# EAGLE design sa612_lm386 (EAGLE 9.6.2)
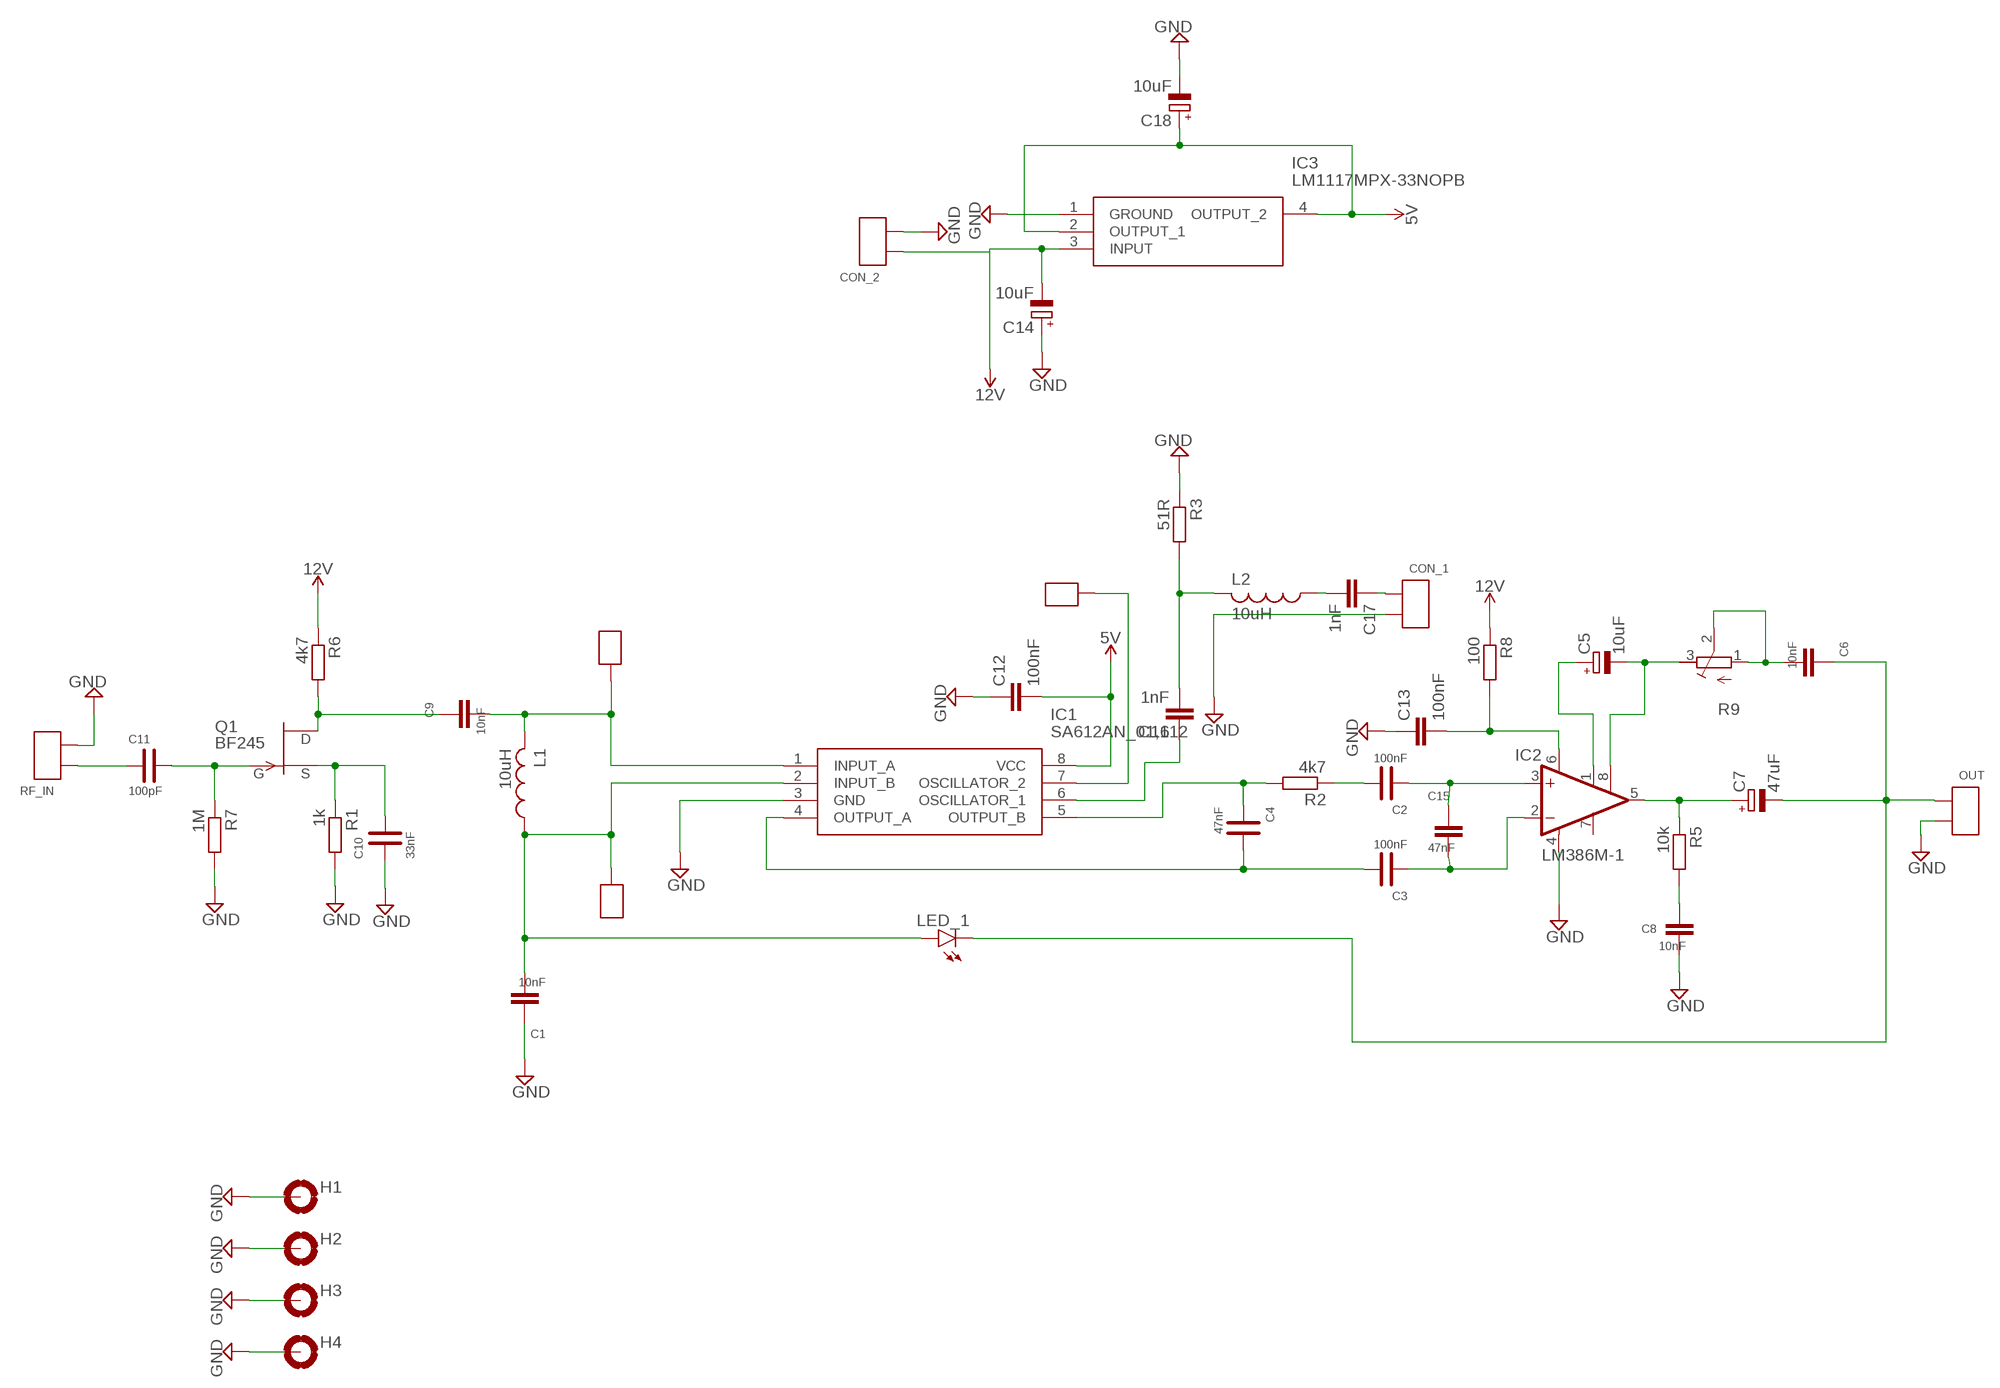
[diagram p0: schematic, sheet 1]

## Parts
C1  10nF  C_0805_SMD  [C0805]
C2  100nF  C_0805_PTH  [C0805K]
C3  100nF  C_0805_PTH  [C0805K]
C4  47nF  C_0805_PTH  [C0805K]
C5  10uF  C_POL  [E5-5]
C6  10nF  C_0805_SMD  [C0805]
C7  47uF  C_POL  [E5-5]
C8  10nF  C_0805_SMD  [C0805]
C9  10nF  C_0805_SMD  [C0805]
C10  33nF  C_0805_PTH  [C0805K]
C11  100pF  C_0805_PTH  [C0805K]
C12  100nF  C_0805_SMD  [C0805]
C13  100nF  C_0805_SMD  [C0805]
C14  10uF  C_POL  [E5-5]
C15  47nF  C_0805_SMD  [C0805]
C16  1nF  C_0805_SMD  [C0805]
C17  1nF  C_0805_SMD  [C0805]
C18  10uF  C_POL  [E5-5]
CON_1  2X_SMD_PTH_PIN  [2X_SMD_PTH]
CON_2  2X_SMD_PTH_PIN  [2X_SMD_PTH]
H1  MOUNT-PAD-ROUND3.0  [3,0-PAD]
H2  MOUNT-PAD-ROUND3.0  [3,0-PAD]
H3  MOUNT-PAD-ROUND3.0  [3,0-PAD]
H4  MOUNT-PAD-ROUND3.0  [3,0-PAD]
IC1  SA612AN_01,112  [DIP762W53P254L950H420Q8N]
IC2  LM386M-1  [SO08]
IC3  LM1117MPX-33NOPB  [SOT230P700X180-4N]
IN_A  SMD_PIN  [SMD_PIN]
IN_B  SMD_PIN  [SMD_PIN]
L1  10uH  L_0805_PTH  [M0805]
L2  10uH  L_0805_PTH  [M0805]
LED_1  LED_0805_PTH  [CHIP-LED0805]
OUT  2X_SMD_PTH_PIN  [2X_SMD_PTH]
P_1  SMD_PIN  [SMD_PIN]
Q1  BF245  [TO92]
R1  1k  R_0805_PTH  [R0805]
R2  4k7  R_0805_SMD  [R0805W]
R3  51R  R_0805_SMD  [R0805W]
R5  10k  R_0805_SMD  [R0805W]
R6  4k7  R_0805_PTH  [R0805]
R7  1M  R_0805_PTH  [R0805]
R8  100  R_0805_SMD  [R0805W]
R9  R-TRIMM64W  [RTRIM64W]
RF_IN  2X_SMD_PTH_PIN  [2X_SMD_PTH]

## Nets
5V: C12.2 C18.+ IC1.8(VCC) IC3.2(OUTPUT_1) IC3.4(OUTPUT_2)
12V: C14.- CON_2.P$1(PIN0) CON_2.T$1(PIN0) IC3.3(INPUT) R6.1 R6.P$1 R8.1
GND: C1.1 C8.2 C10.1 C10.P$1 C12.1 C13.1 C14.+ C18.- CON_1.P$2(PIN1) CON_1.T$2(PIN1) CON_2.P$2(PIN1) CON_2.T$2(PIN1) H1.B3,0(MOUNT) H2.B3,0(MOUNT) H3.B3,0(MOUNT) H4.B3,0(MOUNT) IC1.3(GND) IC2.4(GND) IC3.1(GROUND) OUT.P$2(PIN1) OUT.T$2(PIN1) R1.2 R1.P$2 R3.1 R7.2 R7.P$2 RF_IN.P$2(PIN1) RF_IN.T$2(PIN1)
N$1: C9.2 IC1.1(INPUT_A) IN_A.P$1 L1.2 L1.P$2
N$2: C1.2 IC1.2(INPUT_B) IN_B.P$1 L1.1 L1.P$1 LED_1.A LED_1.AP(A)
N$3: C2.1 C2.P$1 C15.1 IC2.3(+IN)
N$4: C3.1 C3.P$1 C15.2 IC2.2(-IN)
N$5: C16.2 L2.2 L2.P$2 R3.2
N$6: C2.2 C2.P$2 R2.1
N$7: C4.1 C4.P$1 IC1.5(OUTPUT_B) R2.2
N$8: C3.2 C3.P$2 C4.2 C4.P$2 IC1.4(OUTPUT_A)
N$9: C16.1 IC1.6(OSCILLATOR_1)
N$10: IC1.7(OSCILLATOR_2) P_1.P$1
N$11: C5.+ IC2.1(GAIN)
N$12: C5.- IC2.8(GAIN) R9.3(E)
N$13: C6.2 R9.1(A) R9.2(S)
N$14: C6.1 C7.- LED_1.C LED_1.CP(C) OUT.P$1(PIN0) OUT.T$1(PIN0)
N$15: C7.+ IC2.5(OUT) R5.1
N$16: C8.1 R5.2
N$17: C10.2 C10.P$2 Q1.2(S) R1.1 R1.P$1
N$18: C9.1 Q1.1(D) R6.2 R6.P$2
N$19: C11.2 C11.P$2 Q1.3(G) R7.1 R7.P$1
N$20: C11.1 C11.P$1 RF_IN.P$1(PIN0) RF_IN.T$1(PIN0)
N$21: C13.2 IC2.6(VS) R8.2
N$22: C17.1 CON_1.P$1(PIN0) CON_1.T$1(PIN0)
N$23: C17.2 L2.1 L2.P$1
Unconnected: IC2.7(BYPASS)

## Library data of the parts
C1 C6 C8 C9 C12 C13 C15-C17 = mylib:C_0805_SMD
C2-C4 C10 C11 = mylib:C_0805_PTH
C5 C7 C14 C18 = mylib:C_POL
CON_1 CON_2 OUT RF_IN = mylib:2X_SMD_PTH_PIN
H1-H4 = holes:MOUNT-PAD-ROUND: MOUNTING PAD, round
IC1 = SA612AN_01_112:SA612AN_01,112: NXP SA612AN, Mixer Circuit Gain=17 dB 4.5 8 V 8-Pin PDIP Source: Datasheet <https://datasheet.datasheetarchive.com/originals/distributors/Datasheets_SAMA/f801acdc6cb9d9748f3d91798dd5a70c.pdf>; DESCRIPTION: NXP SA612AN, Mixer Circuit Gain=17 dB 4.5 8 V 8-Pin PDIP; HEIGHT: 4.2mm; MANUFACTURER_NAME: Nexperia; MANUFACTURER_PART_NUMBER: SA612AN/01,112; MOUSER_PART_NUMBER: 771-SA612AN/01; MOUSER_PRICE-STOCK: https://www.mouser.com/Search/Refine.aspx?Keyword=771-SA612AN%2F01
IC2 = linear:LM386?-*: Low Voltage Audio Power Amplifier Source: http://cache.national.com/ds/LM/LM386.pdf
IC3 = LM1117MPX-33NOPB:LM1117MPX-33NOPB: LDO Voltage Regulators 800-mA 15-V linear voltage regulator 800-mA 15-V linear voltage regulator Source: Datasheet <https://www.arrow.com/en/products/lm1117mpx-33nopb/on-semiconductor>; ARROW_PART_NUMBER: LM1117MPX-33NOPB; ARROW_PRICE-STOCK: https://www.arrow.com/en/products/lm1117mpx-33nopb/on-semiconductor?region=nac; DESCRIPTION: LDO Voltage Regulators 800-mA 15-V linear voltage regulator 800-mA 15-V linear voltage regulator; HEIGHT: 1.8mm; MANUFACTURER_NAME: onsemi; MANUFACTURER_PART_NUMBER: LM1117MPX-33NOPB; MOUSER_PART_NUMBER: 863-LM1117MPX-33NOPB; MOUSER_PRICE-STOCK: https://www.mouser.co.uk/ProductDetail/onsemi/LM1117MPX-33NOPB?qs=DPoM0jnrROUIbzbQHFmeig%3D%3D
IN_A IN_B P_1 = mylib:SMD_PIN
L1 L2 = mylib:L_0805_PTH
LED_1 = mylib:LED_0805_PTH
Q1 = transistor-fet:BF245: N-Channel Junction FET http://www.onsemi.com/pub/Collateral/BF245A-D.PDF
R1 R6 R7 = mylib:R_0805_PTH
R2 R3 R5 R8 = mylib:R_0805_SMD
R9 = rcl:R-TRIMM: Trimm resistor; SPICEMODEL: X; SPICEPREFIXL: POT

## Board
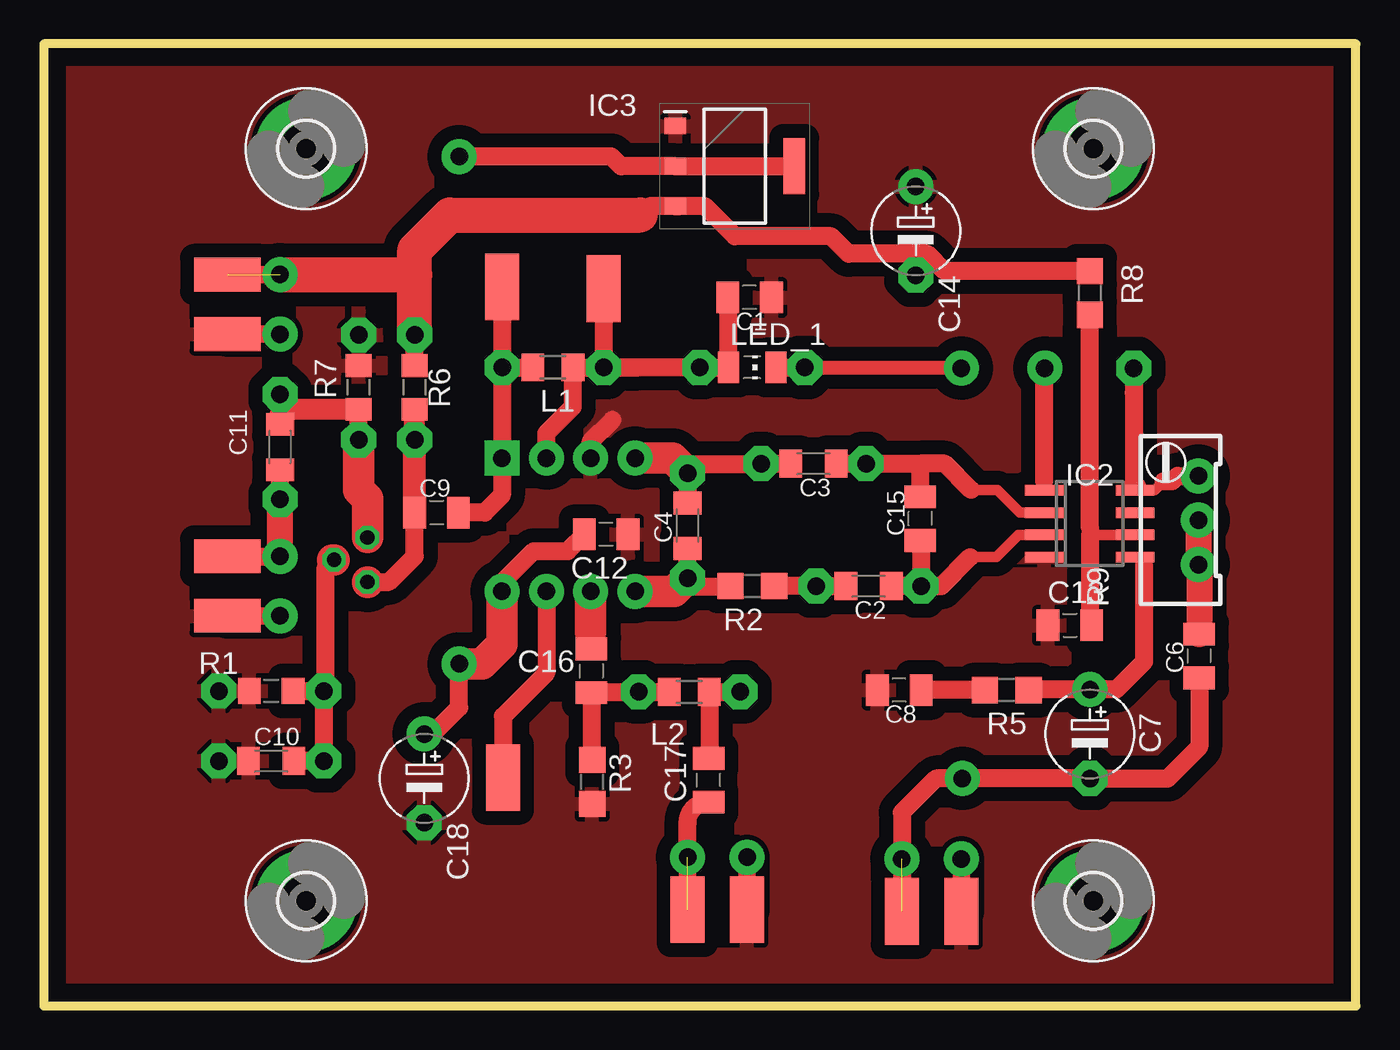
[diagram p1: board, top side]
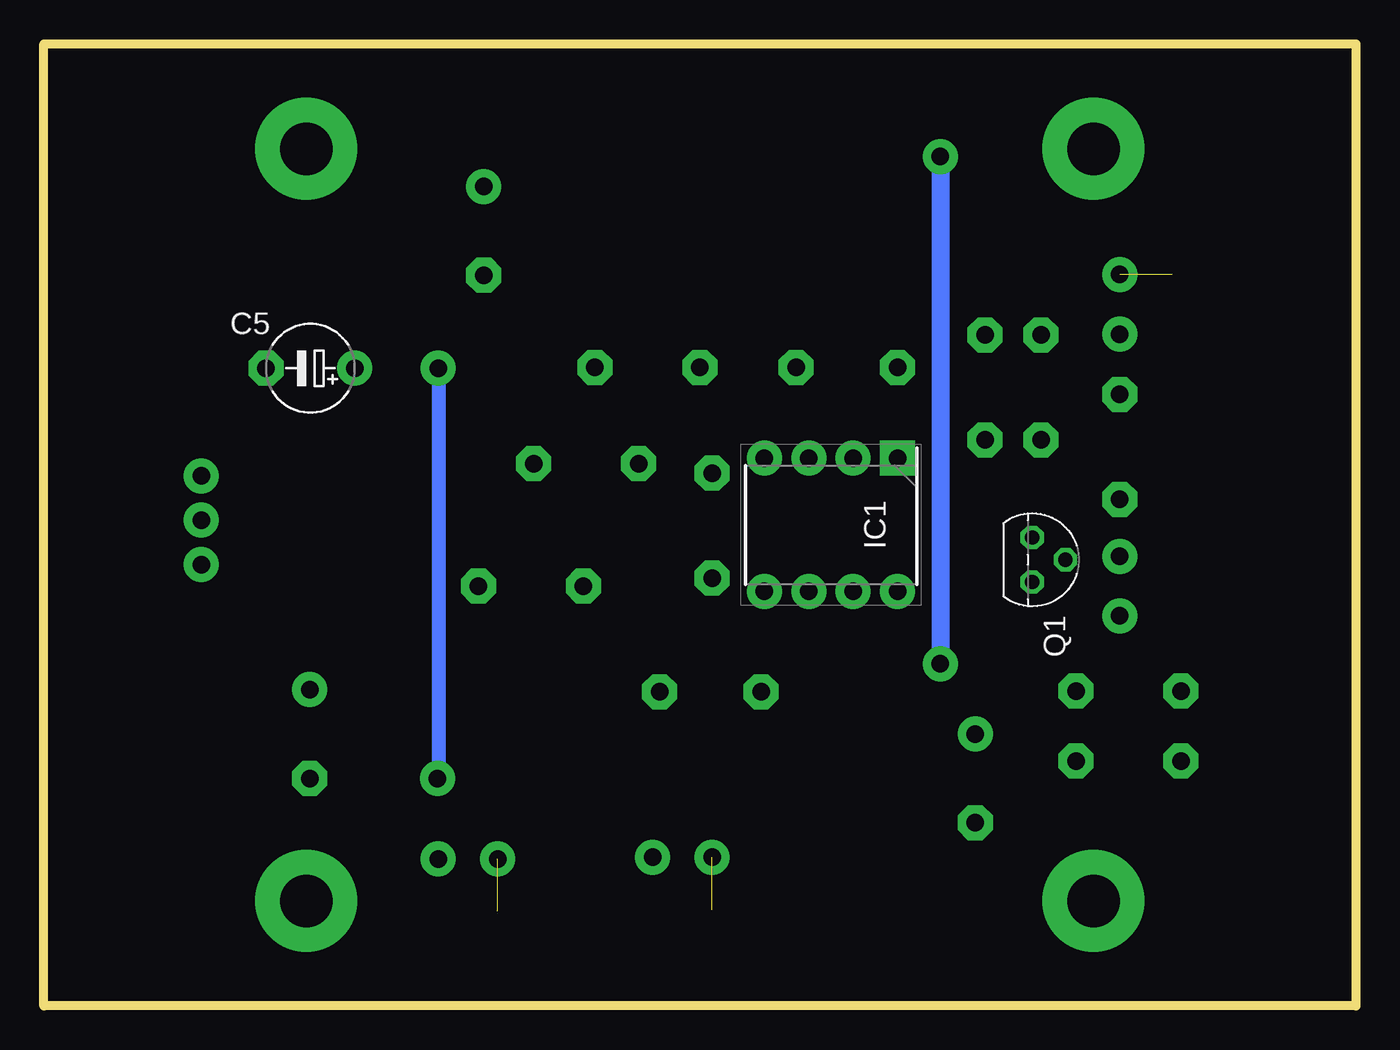
[diagram p2: board, bottom side, seen from below]

Size 75 x 55 mm. Coordinates in mm from the lower left corner, seen from the top.
Outline: 0,0 75,0 75,55 0,55 0,0
Copper layers (1*16): Top 0.035mm / dielectric 1.5mm / Bottom 0.035mm
Design rules "default": minimum track width 6mil, minimum drill 0.35mm, track to track 6mil, track to pad 6mil, pad to pad 6mil, via to via 6mil, smd to smd 6mil, copper to edge 40mil, drill to drill 6mil, minimum pad ring 10mil, minimum via ring 8mil, stop-mask expansion 4mil, vias tented up to drill 0mil, thermal gap 10mil

### Footprints (pad centres in the part's own frame; a part is rotated, then mirrored left to right if it is on the bottom)
C0805 = smd 1.3 x 1.8: 1 -1.25,0; 2 1.25,0
C0805K = smd 1.3 x 1.6: 1 -1.3,0; 2 1.3,0 | drill 1 pad 2 octagon: P$1 -3,0; P$2 3,0
E5-5 = drill 1 pad 2: + -2.54,0 | drill 1 pad 2 octagon: - 2.54,0
2X_SMD_PTH = smd 3.81 x 1.93: P$1 0,1.7; P$2 0,-1.7 | drill 1 pad 2: T$1 3,1.7; T$2 3,-1.7
3,0-PAD = drill 3 pad 5.842: B3,0 0,0
DIP762W53P254L950H420Q8N = drill 1 pad 2 square: 1 -3.81,3.81 | drill 1 pad 2: 2 -3.81,1.27; 3 -3.81,-1.27; 4 -3.81,-3.81; 5 3.81,-3.81; 6 3.81,-1.27; 7 3.81,1.27; 8 3.81,3.81
SO08 = smd 0.6 x 2.2: 1 -1.905,-2.6; 2 -0.635,-2.6; 3 0.635,-2.6; 4 1.905,-2.6; 5 1.905,2.6; 6 0.635,2.6; 7 -0.635,2.6; 8 -1.905,2.6
SOT230P700X180-4N = smd 1.25 x 0.95: 1 -3.4,2.3; 2 -3.4,0; 3 -3.4,-2.3 | smd 1.25 x 3.2: 4 3.4,0
SMD_PIN = smd 1.93 x 3.81: P$1 0,0
M0805 = smd 1.3 x 1.6: 1 -1.15,0; 2 1.15,0 | drill 1 pad 2 octagon: P$1 -2.9,0; P$2 2.9,0
CHIP-LED0805 = smd 1.8 x 1.2: A 0,-1.35; C 0,1.35 | drill 1 pad 2 octagon: AP 0,-3; CP 0,3
TO92 = drill 0.813 octagon: 1 1.27,0; 2 0,1.905; 3 -1.27,0
R0805 = smd 1.3 x 1.5: 1 -1.25,0; 2 1.25,0 | drill 1 pad 2 octagon: P$1 -3,0; P$2 3,0
R0805W = smd 1.5 x 1.5: 1 -1.252,0; 2 1.252,0
RTRIM64W = drill 1 pad 2: 1 1.27,-2.54; 2 1.27,0; 3 1.27,2.54

### Placement (x,y rotation side)
C1  40.35,40.5 180 top
C2  47.15,24 180 top
C3  44,31 180 top
C4  36.8,27.45 90 top
C5  59.76,36.45 180 bottom
C6  66.05,20 90 top
C7  59.8,15.54 270 top
C8  48.9,18.05 180 top
C9  22.45,28.2 0 top
C10  13,14 0 top
C11  13.5,31.95 90 top
C12  32.15,26.95 180 top
C13  58.65,21.75 0 top
C14  49.85,44.3 270 top
C15  50.1,27.85 90 top
C16  31.3,19.15 270 top
C17  38,12.9 90 top
C18  21.75,13 270 top
CON_1  38.5,5.5 90 top
CON_2  10.5,40.1 0 top
H1  15,6 0 top
H2  60,6 0 top
H3  15,49 0 top
H4  60,49 0 top
IC1  30,27.5 270 bottom
IC2  59.79,27.56 270 top
IC3  39.5,48 0 top
IN_A  26.2,41.1 0 top
IN_B  32,41 180 top
L1  29.1,36.5 180 top
L2  36.9,17.95 180 top
LED_1  40.5,36.5 270 top
OUT  50.75,5.4 90 top
P_1  26.25,13.05 180 top
Q1  18.5,25.5 270 bottom
R1  13,18 180 top
R2  40.5,24 180 top
R3  31.35,12.8 90 top
R5  55.05,18.05 180 top
R6  21.2,35.35 270 top
R7  18,35.35 90 top
R8  59.8,40.75 270 top
R9  64.73,27.76 0 top
RF_IN  10.5,24 0 top

### Tracks (layer width: path | path; a pad name or v marks a point on that pad's centre or on a via)
5V  (via drill 1 pad 2)
  Top 1.016: IC3.4 IC3.2 33,48 32.45,48.55 v23.75,48.55 | C18.+ 22.24,15.54 23.75,17.05 v23.75,19.55 | IC1.8 26.19,24.19 28,26 29.95,26 C12.2
  Top 1.8: IC1.8 26.19,20.69 25.05,19.55 v23.75,19.55
  Bottom 1.016: v23.75,48.55 v23.74,48.54 23.74,19.74 23.75,19.73 v23.75,19.55
12V  (1 unrouted)
  Top 1.016: R6.1 R6.P$1 | R8.1 51.49,42.01 50.5,43 50,43 | 50,43 46,43 45,44 39.5,44 37.8,45.7 IC3.3 | IC3.3 36.3,45.7 | 34.1,45.2 34.6,45.7 IC3.3 | C14.- 49.85,42.85 50,43
  Top 2: CON_2.T$1 21.2,41.8 | R6.P$1 21.2,41.8 | 21.2,41.8 21.2,43.2 23.2,45.2 34.1,45.2
GND
  Top 1.016: IC1.3 31.27,32.27 32.5,33.5
  pour Top (isolate 0.8): -3,57.5 -3,-4 77.5,-4 77.5,57.5
N$1
  Top 0.813: L1.P$2 26.1,36.6
  Top 1.016: L1.P$2 26.2,35.85 26.19,35.84 IC1.1 26.19,29.19 25.2,28.2 C9.2 | L1.P$2 L1.2 | IN_A.P$1 L1.P$2
N$2
  Top 1.016: L1.P$1 34,36.5 | LED_1.AP L1.P$1 | LED_1.AP LED_1.A | LED_1.AP 39,36.5 39.1,36.6 C1.2 | IN_B.P$1 L1.P$1 | IC1.2 28.73,32.73 30.25,34.25 L1.1 L1.P$1
N$3
  Top 0.61: 52.95,25.65 54.45,25.65 55.73,26.93 IC2.3
  Top 1.016: C15.1 50.15,26.55 C2.P$1 | C2.P$1 C2.1 | C2.P$1 51.3,24 52.95,25.65
N$4
  Top 0.61: IC2.2 55.8,28.2 54.5,29.5 53,29.5
  Top 1.016: C3.1 C3.P$1 50.1,31 | C15.2 50.1,31 | 53,29.5 51.5,31 50.1,31
N$5
  Top 1.016: 31.35,17.95 C16.2 arc-90 31.35,17.95 | R3.2 31.35,17.95 | 31.35,17.95 L2.P$2 L2.2
N$6
  Top 1.016: C2.2 C2.P$2 R2.1
N$7
  Top 1.016: C4.1 C4.P$1 37.3,23.95 38.8,23.95 38.85,24 R2.2
  Top 1.8: IC1.5 36.04,23.69 C4.P$1
N$8
  Top 1.016: C4.2 C4.P$2 37.3,30.95 40.95,30.95 C3.P$2 C3.2
  Top 1.8: IC1.4 35.94,31.31 C4.P$2
N$9
  Top 1.016: 31.3,21.3 C16.1
  Top 1.5: 31.27,21.33 31.3,21.3
  Top 1.8: IC1.6 31.27,21.33
N$10
  Top 1.016: IC1.7 28.73,19.03 26.25,16.55 P_1.P$1
N$11
  Top 0.61: IC2.1 57.19,29.99 57.2,30
  Top 1.016: 57.19,29.99 57.19,36.42 C5.+
N$12
  Top 0.61: 62.5,29.7 62.5,29.57 IC2.8 62.42,29.5 63.5,29.5 64,30
  Top 1.016: 62.5,29.7 62.3,29.9 C5.- 62.3,35.05 | 64,30 64.5,30 64.8,30.3 R9.3
N$13
  Top 1.016: 66.05,25.17 R9.1
  Top 1.5: R9.2 R9.1 | 66.05,25.17 C6.2
N$14  (via drill 1 pad 2)  (1 unrouted)
  Top 0.813: v52.45,36.45 43.55,36.45 LED_1.CP
  Top 1.016: LED_1.C LED_1.CP | C6.1 66.05,14.8 64.25,13 C7.- v52.5,13 51,13 49.05,11.05 OUT.P$1
  Bottom 0.813: v52.45,36.45 v52.44,36.44 52.44,13.06 v52.5,13
N$15
  Top 0.508: IC2.5 62.89,25.16
  Top 1.016: 62.89,25.16 62.89,19.67 61.3,18.08 C7.+ | C7.+ 59.62,17.91 | R5.1 56.34,18.08 C7.+
N$16
  Top 1.016: R5.2 C8.1
N$17
  Top 1.016: R1.1 R1.P$1 | Q1.2 16.09,25 16.09,18.09 R1.P$1 | R1.P$1 C10.P$2 C10.2
  Top 1.8: Q1.2 16.5,25.5
N$18
  Top 1.016: Q1.1 19.73,24.23 21.2,25.7 C9.1
  Top 1.2: R6.P$2 R6.2
  Top 1.3: C9.1 R6.P$2
  Top 1.8: Q1.1 18.5,24.2
N$19
  Top 0.813: C11.2 C11.P$2
  Top 1.016: R7.P$1 R7.1
  Top 1.2: C11.2 13.5,33.75 13.85,34.1 R7.1
  Top 1.8: R7.P$1 18,29.5 18.5,29 Q1.3
N$20
  Top 1.016: RF_IN.P$1 RF_IN.T$1 | C11.P$1 C11.1
  Top 1.5: RF_IN.T$1 C11.P$1
N$21
  Top 0.61: IC2.6 59.8,26.93 59.8,27.3
  Top 1.016: 59.8,27.3 R8.2 | C13.2 59.8,21.85 59.8,26.93
N$22  (1 unrouted)
  Top 1.016: CON_1.T$1 36.8,10.45 arc-90 C17.1
N$23
  Top 1.016: L2.P$1 L2.1 38.05,14.2 arc-90 C17.2